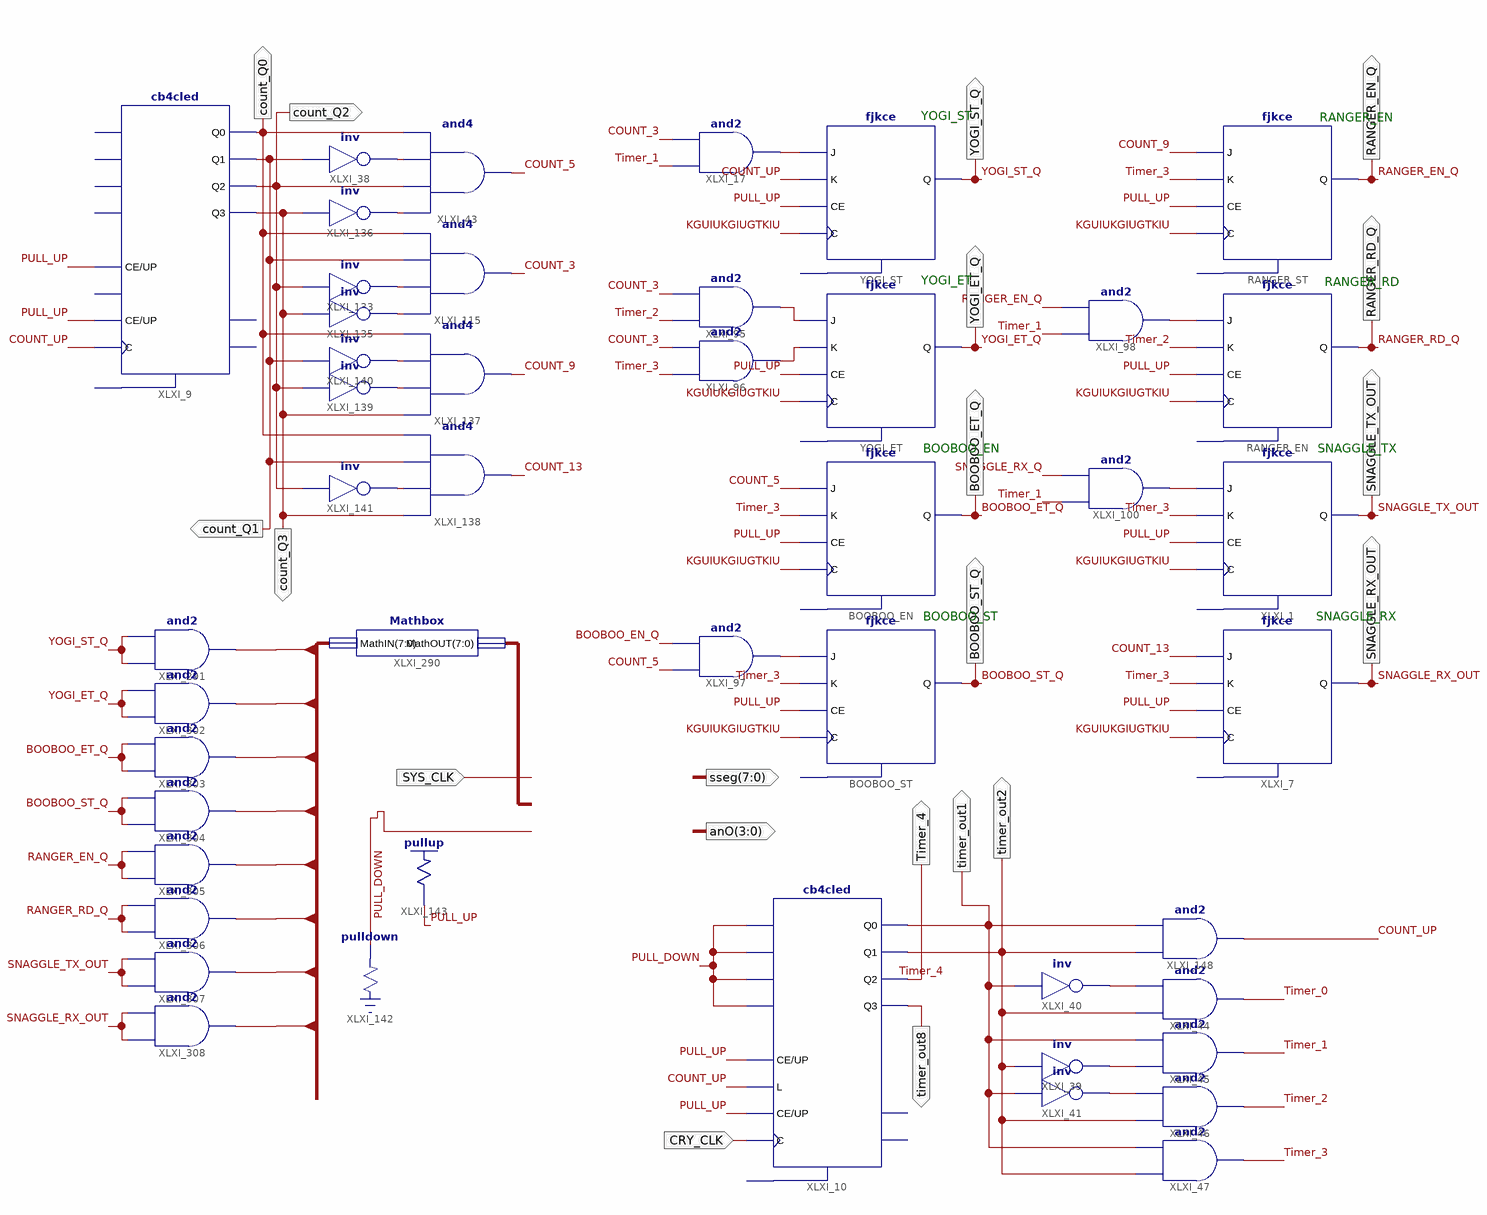
[diagram p0: schematic sheet 1]
// Xilinx ISE schematic Experiment3.sch (spartan3e) as structural Verilog: 46 symbols, 20 ports
module Experiment3 (
  input  CRY_CLK,
  input  SYS_CLK,
  output count_Q0,
  output count_Q3,
  output count_Q1,
  output count_Q2,
  output RANGER_EN_Q,
  output YOGI_ST_Q,
  output BOOBOO_ET_Q,
  output BOOBOO_ST_Q,
  output SNAGGLE_RX_OUT,
  output SNAGGLE_TX_OUT,
  output RANGER_RD_Q,
  output timer_out8,
  output timer_out1,
  output timer_out2,
  output Timer_4,
  output YOGI_ET_Q,
  output [7:0] sseg,
  output [3:0] anO
);

  wire BOOBOO_EN_Q, COUNT_3, COUNT_5, COUNT_9, COUNT_13, COUNT_UP, KGUIUKGIUGTKIU, PULL_DOWN, PULL_UP,
       SNAGGLE_RX_Q, Timer_0, Timer_1, Timer_2, Timer_3, XLXN_22, XLXN_23, XLXN_24, XLXN_36, XLXN_39,
       XLXN_42, XLXN_49, XLXN_57, XLXN_61, XLXN_201, XLXN_202, XLXN_203, XLXN_204, XLXN_209, XLXN_210,
       XLXN_211;
  wire [7:0] Din, MathIN;

  cb4cled XLXI_9 (
    .C(COUNT_UP), .CE(PULL_UP), .UP(PULL_UP), .Q0(count_Q0), .Q1(count_Q1), .Q2(count_Q2), .Q3(count_Q3));  // open: CLR, D0, D1, D2, D3, L, CEO, TC
  and XLXI_43 (COUNT_5, XLXN_202, count_Q2, XLXN_201, count_Q0);
  and XLXI_115 (COUNT_3, XLXN_204, XLXN_203, count_Q1, count_Q0);
  not XLXI_38 (XLXN_201, count_Q1);
  fjkce YOGI_ST (.C(KGUIUKGIUGTKIU), .CE(PULL_UP), .J(XLXN_36), .K(COUNT_UP), .Q(YOGI_ST_Q));  // open: CLR
  fjkce RANGER_ST (.C(KGUIUKGIUGTKIU), .CE(PULL_UP), .J(COUNT_9), .K(Timer_3), .Q(RANGER_EN_Q));  // open: CLR
  fjkce RANGER_EN (.C(KGUIUKGIUGTKIU), .CE(PULL_UP), .J(XLXN_57), .K(Timer_2), .Q(RANGER_RD_Q));  // open: CLR
  fjkce YOGI_ET (.C(KGUIUKGIUGTKIU), .CE(PULL_UP), .J(XLXN_39), .K(XLXN_42), .Q(YOGI_ET_Q));  // open: CLR
  fjkce BOOBOO_EN (.C(KGUIUKGIUGTKIU), .CE(PULL_UP), .J(COUNT_5), .K(Timer_3), .Q(BOOBOO_ET_Q));  // open: CLR
  fjkce XLXI_1 (.C(KGUIUKGIUGTKIU), .CE(PULL_UP), .J(XLXN_61), .K(Timer_3), .Q(SNAGGLE_TX_OUT));  // open: CLR
  fjkce BOOBOO_ST (.C(KGUIUKGIUGTKIU), .CE(PULL_UP), .J(XLXN_49), .K(Timer_3), .Q(BOOBOO_ST_Q));  // open: CLR
  fjkce XLXI_7 (.C(KGUIUKGIUGTKIU), .CE(PULL_UP), .J(COUNT_13), .K(Timer_3), .Q(SNAGGLE_RX_OUT));  // open: CLR
  and XLXI_17 (XLXN_36, Timer_1, COUNT_3);
  and XLXI_97 (XLXN_49, COUNT_5, BOOBOO_EN_Q);
  and XLXI_98 (XLXN_57, Timer_1, RANGER_EN_Q);
  and XLXI_100 (XLXN_61, Timer_1, SNAGGLE_RX_Q);
  and XLXI_95 (XLXN_39, Timer_2, COUNT_3);
  and XLXI_96 (XLXN_42, Timer_3, COUNT_3);
  not XLXI_133 (XLXN_203, count_Q2);
  not XLXI_135 (XLXN_204, count_Q3);
  not XLXI_136 (XLXN_202, count_Q3);
  and XLXI_137 (COUNT_9, count_Q3, XLXN_209, XLXN_210, count_Q0);
  and XLXI_138 (COUNT_13, count_Q3, XLXN_211, count_Q1, count_Q0);
  not XLXI_139 (XLXN_209, count_Q2);
  not XLXI_140 (XLXN_210, count_Q1);
  not XLXI_141 (XLXN_211, count_Q2);
  cb4cled XLXI_10 (
    .C(CRY_CLK), .CE(PULL_UP), .D0(PULL_DOWN), .D1(PULL_DOWN), .D2(PULL_DOWN), .D3(PULL_DOWN), .L(COUNT_UP),
    .UP(PULL_UP), .Q0(timer_out1), .Q1(timer_out2), .Q2(Timer_4), .Q3(timer_out8));  // open: CLR, CEO, TC
  and XLXI_47 (Timer_3, timer_out2, timer_out1);
  and XLXI_46 (Timer_2, timer_out2, XLXN_24);
  not XLXI_41 (XLXN_24, timer_out1);
  and XLXI_45 (Timer_1, XLXN_23, timer_out1);
  not XLXI_39 (XLXN_23, timer_out2);
  not XLXI_40 (XLXN_22, timer_out1);
  and XLXI_44 (Timer_0, timer_out2, XLXN_22);
  and XLXI_148 (COUNT_UP, timer_out2, timer_out1);
  Mathbox XLXI_290 (.MathIN(MathIN), .MathOUT(Din));
  \pulldown  XLXI_142 (.O(PULL_DOWN));
  \pullup  XLXI_143 (.O(PULL_UP));
  and XLXI_291 (MathIN[0], YOGI_ST_Q, YOGI_ST_Q);
  and XLXI_302 (MathIN[1], YOGI_ET_Q, YOGI_ET_Q);
  and XLXI_303 (MathIN[2], BOOBOO_ET_Q, BOOBOO_ET_Q);
  and XLXI_304 (MathIN[3], BOOBOO_ST_Q, BOOBOO_ST_Q);
  and XLXI_305 (MathIN[4], RANGER_EN_Q, RANGER_EN_Q);
  and XLXI_306 (MathIN[5], RANGER_RD_Q, RANGER_RD_Q);
  and XLXI_307 (MathIN[6], SNAGGLE_TX_OUT, SNAGGLE_TX_OUT);
  and XLXI_308 (MathIN[7], SNAGGLE_RX_OUT, SNAGGLE_RX_OUT);

  // Notes on the sheet:
  //   YOGI_ST
  //   RANGER_EN
  //   YOGI_ET
  //   RANGER_RD
  //   BOOBOO_EN
  //   SNAGGLE_TX
  //   BOOBOO_ST
  //   SNAGGLE_RX
endmodule
